# EAGLE schematic STXY (EAGLE 9.6.2)
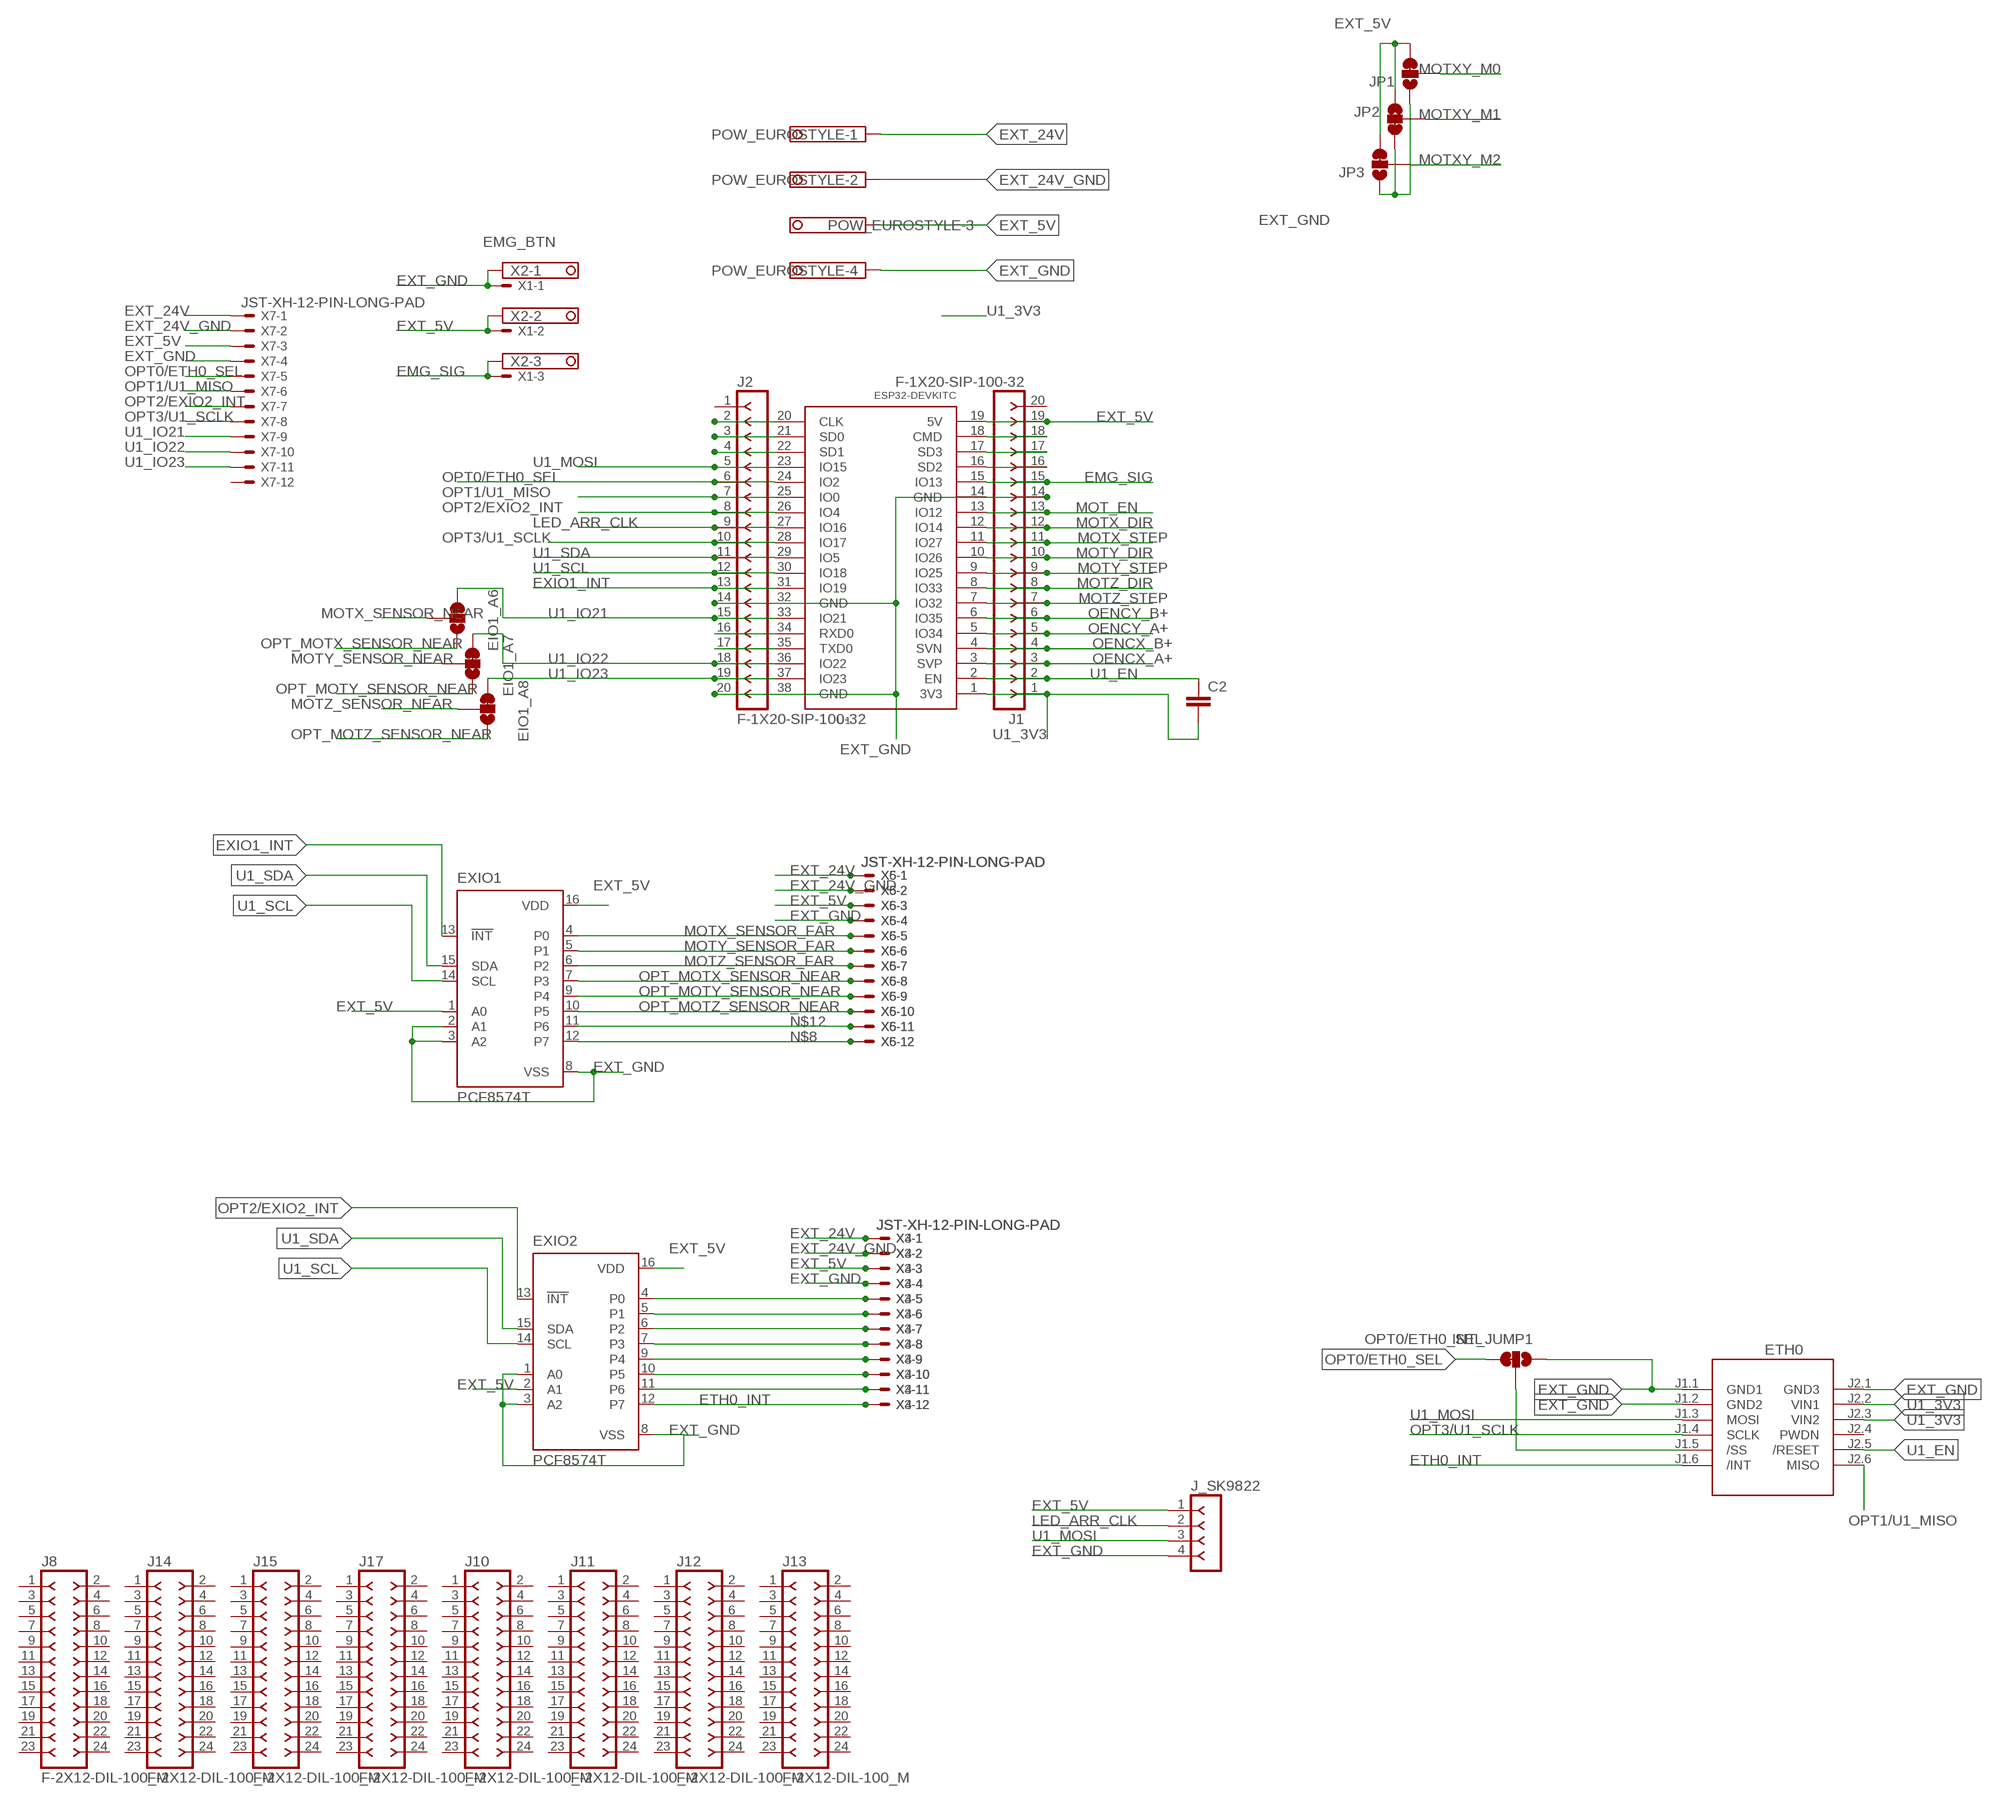
[diagram p0: schematic, sheet 1, part 1 of 3]
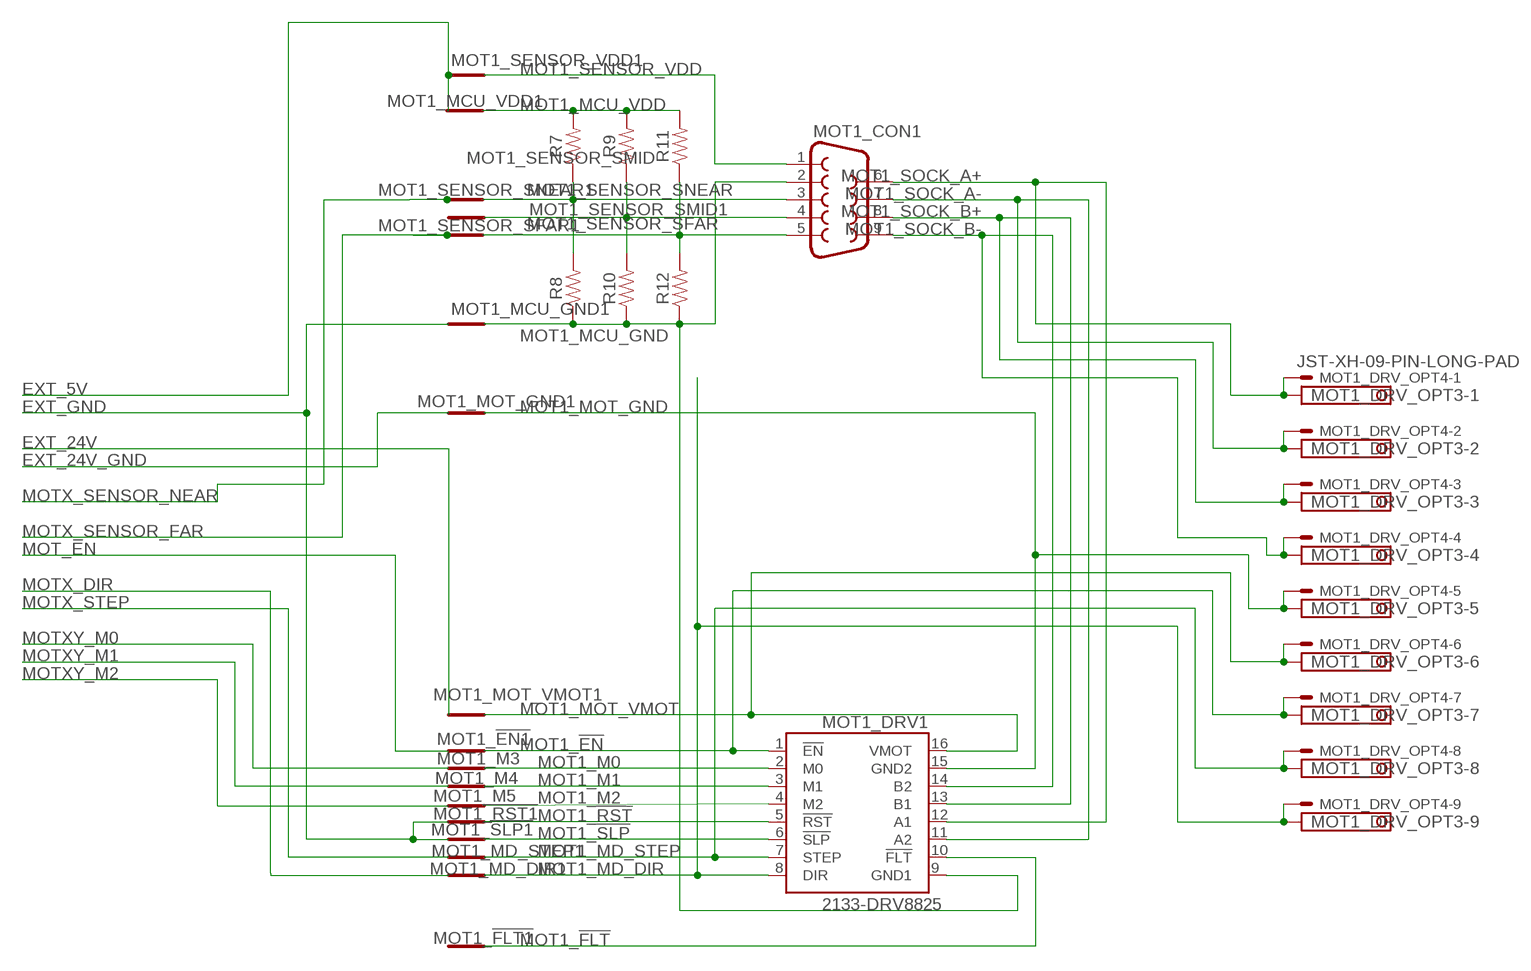
[diagram p1: schematic, sheet 1, part 2 of 3]
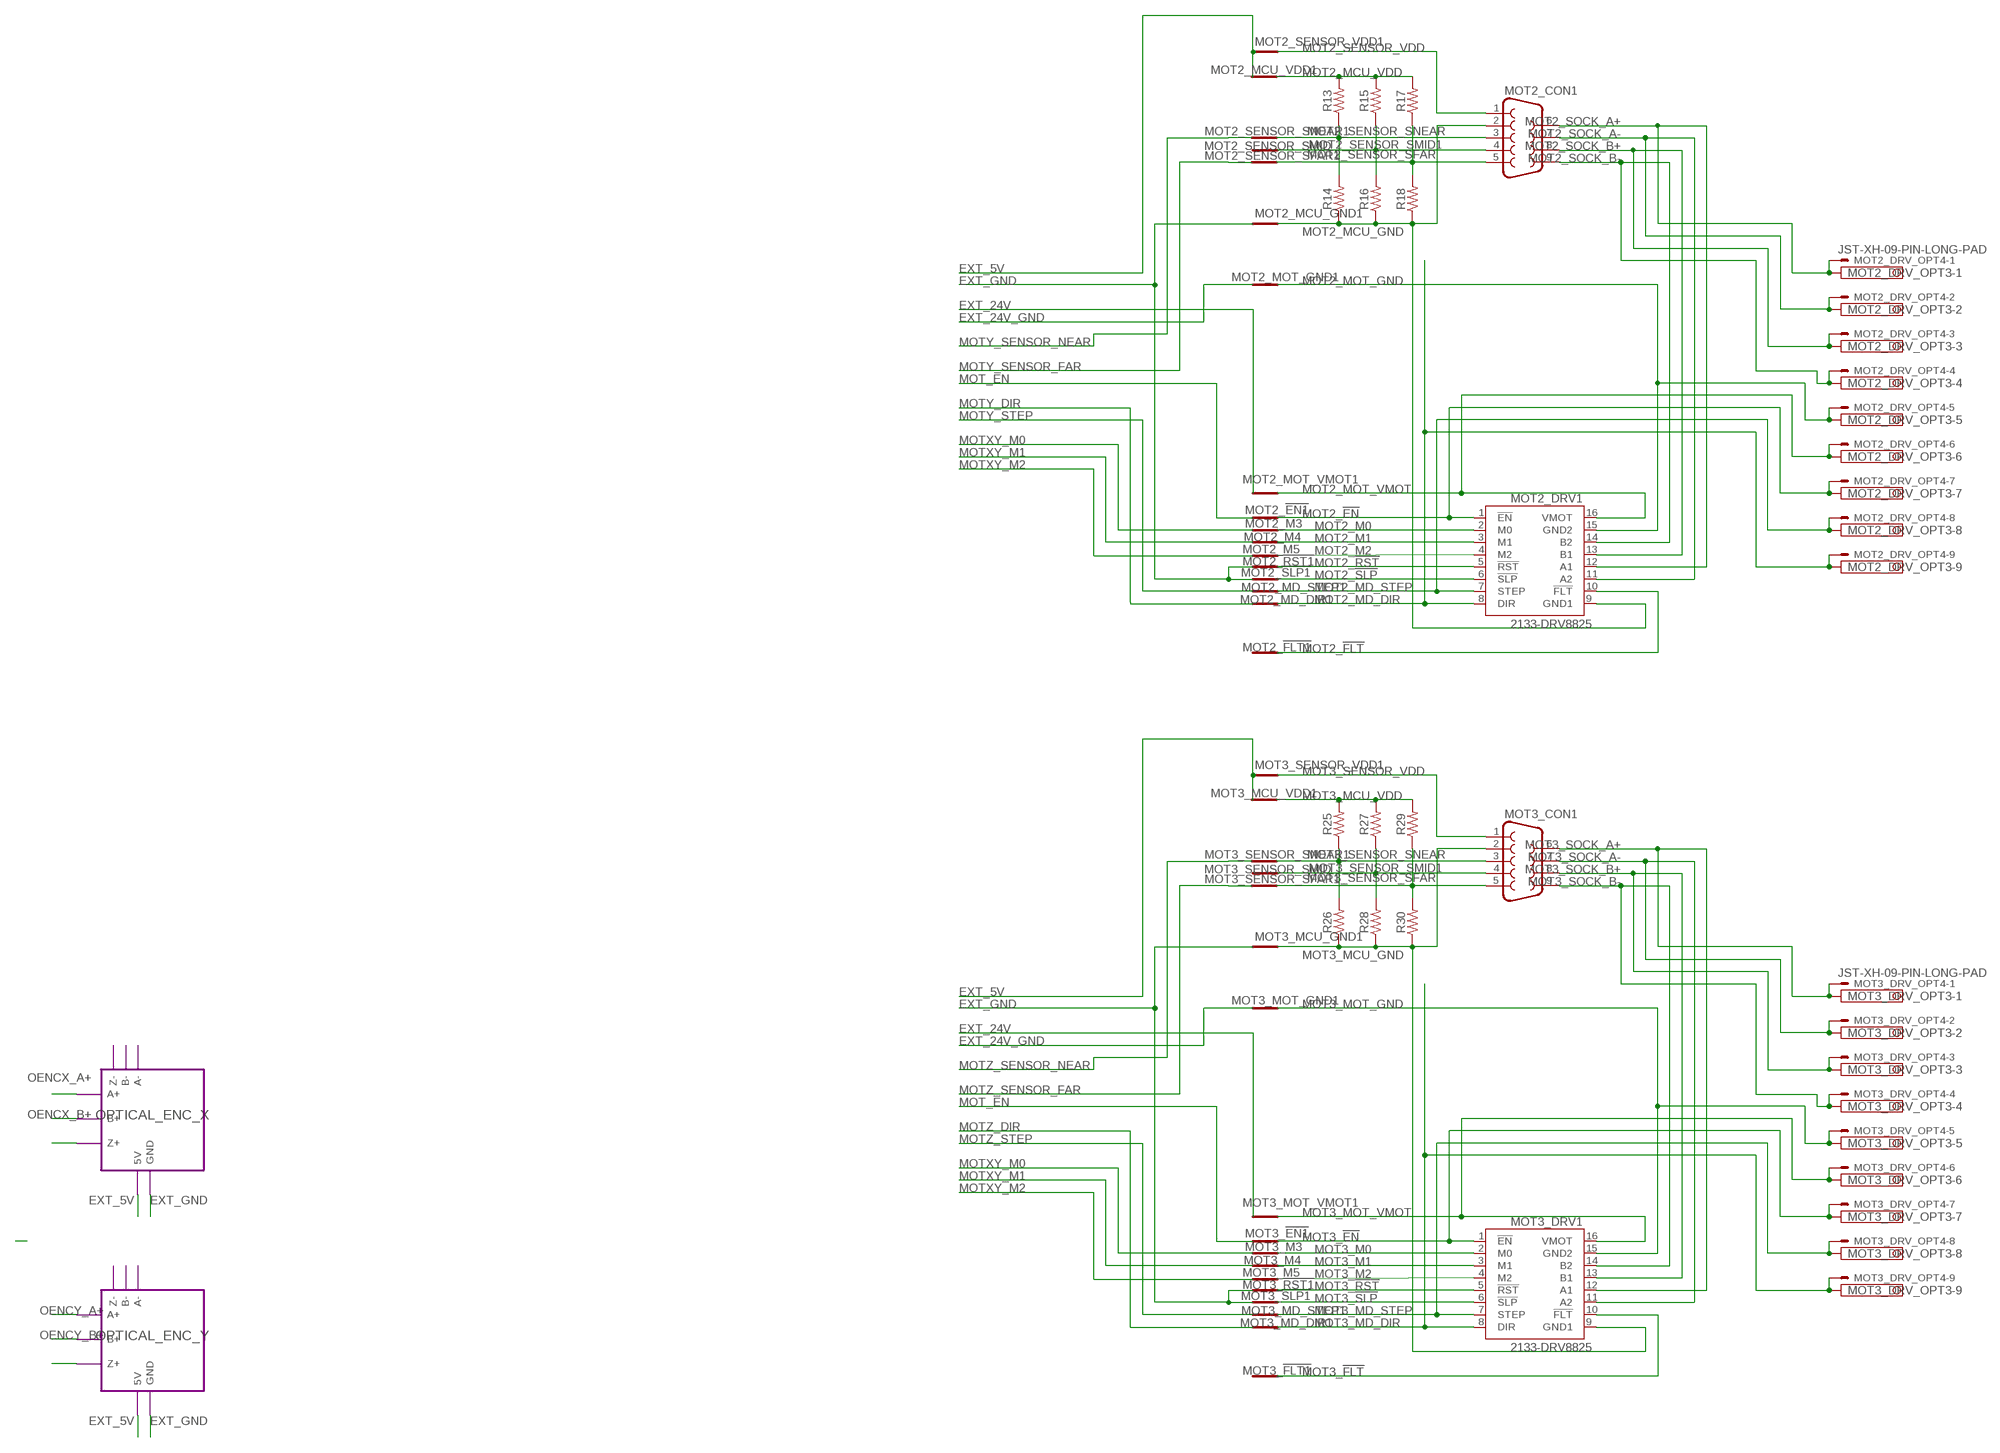
[diagram p2: schematic, sheet 1, part 3 of 3]

## Parts
C2  C2.5/2  [C2.5-2]
EIO1_A6  JUMPER-SMT_3_1-NC_TRACE_SILK  [SMT-JUMPER_3_1-NC_TRACE_SILK]
EIO1_A7  JUMPER-SMT_3_1-NC_TRACE_SILK  [SMT-JUMPER_3_1-NC_TRACE_SILK]
EIO1_A8  JUMPER-SMT_3_1-NC_TRACE_SILK  [SMT-JUMPER_3_1-NC_TRACE_SILK]
ETH0  WIZ820IO_DEVICE'DUAL-IN-LINE'  [WIZ820IO]
EXIO1  PCF8574T  [SO16W]
EXIO2  PCF8574T  [SO16W]
INT_JUMP1  JUMPER-SMT_3_1-NC_TRACE_SILK  [SMT-JUMPER_3_1-NC_TRACE_SILK]
J1  F-1X20-SIP-100-32  [SIP-100-20-32]
J2  F-1X20-SIP-100-32  [SIP-100-20-32]
J8  F-2X12-DIL-100_M  [DIL-100-2X12_M]
J10  F-2X12-DIL-100_M  [DIL-100-2X12_M]
J11  F-2X12-DIL-100_M  [DIL-100-2X12_M]
J12  F-2X12-DIL-100_M  [DIL-100-2X12_M]
J13  F-2X12-DIL-100_M  [DIL-100-2X12_M]
J14  F-2X12-DIL-100_M  [DIL-100-2X12_M]
J15  F-2X12-DIL-100_M  [DIL-100-2X12_M]
J17  F-2X12-DIL-100_M  [DIL-100-2X12_M]
J_SK9822  F-1X04-SIP-100-40Y  [SIP-100-04-40Y]
JP1  JUMPER-SMT_3_1-NC_TRACE_SILK  [SMT-JUMPER_3_1-NC_TRACE_SILK]
JP2  JUMPER-SMT_3_1-NC_TRACE_SILK  [SMT-JUMPER_3_1-NC_TRACE_SILK]
JP3  JUMPER-SMT_3_1-NC_TRACE_SILK  [SMT-JUMPER_3_1-NC_TRACE_SILK]
MOT1_!EN1  SHORTT5  [SHORT_TOP-50]
MOT1_!FLT1  SHORTT5  [SHORT_TOP-50]
MOT1_!RST1  SHORTT5  [SHORT_TOP-50]
MOT1_!SLP1  SHORTT5  [SHORT_TOP-50]
MOT1_CON1  F09VP  [F09VP]
MOT1_DRV1  2133-DRV8825  [DRV8825]
MOT1_DRV_OPT3  TERMINAL-BLOCK-3.5MM-9-PIN-ROUND-PAD  [TERMINAL-BLOCK-9-PIN-3.5MM-ROUND-PAD]
MOT1_DRV_OPT4  JST-XH-09-PIN-LONG-PAD  [JST-XH-09-PACKAGE-LONG-PAD]
MOT1_M3  SHORTT5  [SHORT_TOP-50]
MOT1_M4  SHORTT5  [SHORT_TOP-50]
MOT1_M5  SHORTT5  [SHORT_TOP-50]
MOT1_MCU_GND1  SHORTT5  [SHORT_TOP-50]
MOT1_MCU_VDD1  SHORTT5  [SHORT_TOP-50]
MOT1_MD_DIR1  SHORTT5  [SHORT_TOP-50]
MOT1_MD_STEP1  SHORTT5  [SHORT_TOP-50]
MOT1_MOT_GND1  SHORTT5  [SHORT_TOP-50]
MOT1_MOT_VMOT1  SHORTT5  [SHORT_TOP-50]
MOT1_SENSOR_SFAR1  SHORTT5  [SHORT_TOP-50]
MOT1_SENSOR_SMID1  SHORTT5  [SHORT_TOP-50]
MOT1_SENSOR_SNEAR1  SHORTT5  [SHORT_TOP-50]
MOT1_SENSOR_VDD1  SHORTT5  [SHORT_TOP-50]
MOT2_!EN1  SHORTT5  [SHORT_TOP-50]
MOT2_!FLT1  SHORTT5  [SHORT_TOP-50]
MOT2_!RST1  SHORTT5  [SHORT_TOP-50]
MOT2_!SLP1  SHORTT5  [SHORT_TOP-50]
MOT2_CON1  F09VP  [F09VP]
MOT2_DRV1  2133-DRV8825  [DRV8825]
MOT2_DRV_OPT3  TERMINAL-BLOCK-3.5MM-9-PIN-ROUND-PAD  [TERMINAL-BLOCK-9-PIN-3.5MM-ROUND-PAD]
MOT2_DRV_OPT4  JST-XH-09-PIN-LONG-PAD  [JST-XH-09-PACKAGE-LONG-PAD]
MOT2_M3  SHORTT5  [SHORT_TOP-50]
MOT2_M4  SHORTT5  [SHORT_TOP-50]
MOT2_M5  SHORTT5  [SHORT_TOP-50]
MOT2_MCU_GND1  SHORTT5  [SHORT_TOP-50]
MOT2_MCU_VDD1  SHORTT5  [SHORT_TOP-50]
MOT2_MD_DIR1  SHORTT5  [SHORT_TOP-50]
MOT2_MD_STEP1  SHORTT5  [SHORT_TOP-50]
MOT2_MOT_GND1  SHORTT5  [SHORT_TOP-50]
MOT2_MOT_VMOT1  SHORTT5  [SHORT_TOP-50]
MOT2_SENSOR_SFAR1  SHORTT5  [SHORT_TOP-50]
MOT2_SENSOR_SMID1  SHORTT5  [SHORT_TOP-50]
MOT2_SENSOR_SNEAR1  SHORTT5  [SHORT_TOP-50]
MOT2_SENSOR_VDD1  SHORTT5  [SHORT_TOP-50]
MOT3_!EN1  SHORTT5  [SHORT_TOP-50]
MOT3_!FLT1  SHORTT5  [SHORT_TOP-50]
MOT3_!RST1  SHORTT5  [SHORT_TOP-50]
MOT3_!SLP1  SHORTT5  [SHORT_TOP-50]
MOT3_CON1  F09VP  [F09VP]
MOT3_DRV1  2133-DRV8825  [DRV8825]
MOT3_DRV_OPT3  TERMINAL-BLOCK-3.5MM-9-PIN-ROUND-PAD  [TERMINAL-BLOCK-9-PIN-3.5MM-ROUND-PAD]
MOT3_DRV_OPT4  JST-XH-09-PIN-LONG-PAD  [JST-XH-09-PACKAGE-LONG-PAD]
MOT3_M3  SHORTT5  [SHORT_TOP-50]
MOT3_M4  SHORTT5  [SHORT_TOP-50]
MOT3_M5  SHORTT5  [SHORT_TOP-50]
MOT3_MCU_GND1  SHORTT5  [SHORT_TOP-50]
MOT3_MCU_VDD1  SHORTT5  [SHORT_TOP-50]
MOT3_MD_DIR1  SHORTT5  [SHORT_TOP-50]
MOT3_MD_STEP1  SHORTT5  [SHORT_TOP-50]
MOT3_MOT_GND1  SHORTT5  [SHORT_TOP-50]
MOT3_MOT_VMOT1  SHORTT5  [SHORT_TOP-50]
MOT3_SENSOR_SFAR1  SHORTT5  [SHORT_TOP-50]
MOT3_SENSOR_SMID1  SHORTT5  [SHORT_TOP-50]
MOT3_SENSOR_SNEAR1  SHORTT5  [SHORT_TOP-50]
MOT3_SENSOR_VDD1  SHORTT5  [SHORT_TOP-50]
POW_EUROSTYLE  TERMINAL-BLOCK-3.5MM-4-PIN-LONG-PAD  [TERMINAL-BLOCK-4-PIN-3.5MM-LONG-PAD]
R7  10KOHM-0603-1/10W-1%  [0603]
R8  10KOHM-0603-1/10W-1%  [0603]
R9  10KOHM-0603-1/10W-1%  [0603]
R10  10KOHM-0603-1/10W-1%  [0603]
R11  10KOHM-0603-1/10W-1%  [0603]
R12  10KOHM-0603-1/10W-1%  [0603]
R13  10KOHM-0603-1/10W-1%  [0603]
R14  10KOHM-0603-1/10W-1%  [0603]
R15  10KOHM-0603-1/10W-1%  [0603]
R16  10KOHM-0603-1/10W-1%  [0603]
R17  10KOHM-0603-1/10W-1%  [0603]
R18  10KOHM-0603-1/10W-1%  [0603]
R25  10KOHM-0603-1/10W-1%  [0603]
R26  10KOHM-0603-1/10W-1%  [0603]
R27  10KOHM-0603-1/10W-1%  [0603]
R28  10KOHM-0603-1/10W-1%  [0603]
R29  10KOHM-0603-1/10W-1%  [0603]
R30  10KOHM-0603-1/10W-1%  [0603]
U1  ESP32DEVKITC  [ESP32-DEVKITC]
X1  EMG_BTN  JST-XH-03-PIN-LONG-PAD  [JST-XH-03-PACKAGE-LONG-PAD]
X2  TERMINAL-BLOCK-3.5MM-3-PIN-LONG-PAD  [TERMINAL-BLOCK-3-PIN-3.5MM-LONG-PAD]
X3  JST-XH-12-PIN-LONG-PAD  [JST-XH-12-PACKAGE-LONG-PAD]
X4  JST-XH-12-PIN-LONG-PAD  [JST-XH-12-PACKAGE-LONG-PAD]
X5  JST-XH-12-PIN-LONG-PAD  [JST-XH-12-PACKAGE-LONG-PAD]
X6  JST-XH-12-PIN-LONG-PAD  [JST-XH-12-PACKAGE-LONG-PAD]
X7  JST-XH-12-PIN-LONG-PAD  [JST-XH-12-PACKAGE-LONG-PAD]

## Module instances
OPTICAL_ENC_X = OPTICAL_ENC
OPTICAL_ENC_Y = OPTICAL_ENC

## Nets
EMG_SIG: J1.15 U1.15(IO13) X1.3 X2.3
ETH0_INT: ETH0.J1.6(/INT) EXIO2.12(P7) X3.12 X4.12
EXIO1_INT: EXIO1.13(!INT) J2.13 U1.31(IO19)
EXT_5V [M POWER]: EXIO1.1(A0) EXIO1.16(VDD) EXIO2.2(A1) EXIO2.16(VDD) J1.19 J_SK9822.1 JP1.3 JP2.1 JP3.3 MOT1_MCU_VDD1.1 MOT1_SENSOR_VDD1.1 MOT2_MCU_VDD1.1 MOT2_SENSOR_VDD1.1 MOT3_MCU_VDD1.1 MOT3_SENSOR_VDD1.1 POW_EUROSTYLE.3 U1.19(5V) X1.2 X2.2 X3.3 X4.3 X5.3 X6.3 X7.3 ; port OPTICAL_ENC_X.5V OPTICAL_ENC_Y.5V
EXT_24V [H POWER]: MOT1_MOT_VMOT1.1 MOT2_MOT_VMOT1.1 MOT3_MOT_VMOT1.1 POW_EUROSTYLE.1 X3.1 X4.1 X5.1 X6.1 X7.1
EXT_24V_GND [H POWER]: MOT1_MOT_GND1.1 MOT2_MOT_GND1.1 MOT3_MOT_GND1.1 POW_EUROSTYLE.2 X3.2 X4.2 X5.2 X6.2 X7.2
EXT_GND [M POWER]: ETH0.J1.1(GND1) ETH0.J1.2(GND2) ETH0.J2.1(GND3) EXIO1.2(A1) EXIO1.3(A2) EXIO1.8(VSS) EXIO2.1(A0) EXIO2.3(A2) EXIO2.8(VSS) INT_JUMP1.1 J1.14 J2.14 J2.20 J_SK9822.4 JP1.1 JP2.3 JP3.1 MOT1_!RST1.1 MOT1_!SLP1.1 MOT1_MCU_GND1.1 MOT2_!RST1.1 MOT2_!SLP1.1 MOT2_MCU_GND1.1 MOT3_!RST1.1 MOT3_!SLP1.1 MOT3_MCU_GND1.1 POW_EUROSTYLE.4 U1.14(GND) U1.32(GND) U1.38(GND) X1.1 X2.1 X3.4 X4.4 X5.4 X6.4 X7.4 ; port OPTICAL_ENC_X.GND OPTICAL_ENC_Y.GND
LED_ARR_CLK: J2.9 J_SK9822.2 U1.27(IO16)
MOT1_!EN [S POWER]: MOT1_!EN1.2 MOT1_DRV1.1(!EN) MOT1_DRV_OPT3.7 MOT1_DRV_OPT4.7
MOT1_!FLT [S POWER]: MOT1_!FLT1.2 MOT1_DRV1.10(!FLT)
MOT1_!RST [S POWER]: MOT1_!RST1.2 MOT1_DRV1.5(!RST)
MOT1_!SLP [S POWER]: MOT1_!SLP1.2 MOT1_DRV1.6(!SLP)
MOT1_M0 [S POWER]: MOT1_DRV1.2(M0) MOT1_M3.2
MOT1_M1 [S POWER]: MOT1_DRV1.3(M1) MOT1_M4.2
MOT1_M2 [S POWER]: MOT1_DRV1.4(M2) MOT1_M5.2
MOT1_MCU_GND [M POWER]: MOT1_CON1.2 MOT1_DRV1.9(GND1) MOT1_MCU_GND1.2 R8.1 R10.1 R12.1
MOT1_MCU_VDD [M POWER]: MOT1_MCU_VDD1.2 R7.2 R9.2 R11.2
MOT1_MD_DIR [S POWER]: MOT1_DRV1.8(DIR) MOT1_DRV_OPT3.9 MOT1_DRV_OPT4.9 MOT1_MD_DIR1.2
MOT1_MD_STEP [S POWER]: MOT1_DRV1.7(STEP) MOT1_DRV_OPT3.8 MOT1_DRV_OPT4.8 MOT1_MD_STEP1.2
MOT1_MOT_GND [H POWER]: MOT1_DRV1.15(GND2) MOT1_DRV_OPT3.5 MOT1_DRV_OPT4.5 MOT1_MOT_GND1.2
MOT1_MOT_VMOT [H POWER]: MOT1_DRV1.16(VMOT) MOT1_DRV_OPT3.6 MOT1_DRV_OPT4.6 MOT1_MOT_VMOT1.2
MOT1_SENSOR_SFAR [S POWER]: MOT1_CON1.5 MOT1_SENSOR_SFAR1.2 R11.1 R12.2
MOT1_SENSOR_SMID [S POWER]: MOT1_CON1.4 MOT1_SENSOR_SMID1.2 R9.1 R10.2
MOT1_SENSOR_SNEAR [S POWER]: MOT1_CON1.3 MOT1_SENSOR_SNEAR1.2 R7.1 R8.2
MOT1_SENSOR_VDD [M POWER]: MOT1_CON1.1 MOT1_SENSOR_VDD1.2
MOT1_SOCK_A+ [M POWER]: MOT1_CON1.6 MOT1_DRV1.12(A1) MOT1_DRV_OPT3.1 MOT1_DRV_OPT4.1
MOT1_SOCK_A- [M POWER]: MOT1_CON1.7 MOT1_DRV1.11(A2) MOT1_DRV_OPT3.2 MOT1_DRV_OPT4.2
MOT1_SOCK_B+ [M POWER]: MOT1_CON1.8 MOT1_DRV1.13(B1) MOT1_DRV_OPT3.3 MOT1_DRV_OPT4.3
MOT1_SOCK_B- [M POWER]: MOT1_CON1.9 MOT1_DRV1.14(B2) MOT1_DRV_OPT3.4 MOT1_DRV_OPT4.4
MOT2_!EN [S POWER]: MOT2_!EN1.2 MOT2_DRV1.1(!EN) MOT2_DRV_OPT3.7 MOT2_DRV_OPT4.7
MOT2_!FLT [S POWER]: MOT2_!FLT1.2 MOT2_DRV1.10(!FLT)
MOT2_!RST [S POWER]: MOT2_!RST1.2 MOT2_DRV1.5(!RST)
MOT2_!SLP [S POWER]: MOT2_!SLP1.2 MOT2_DRV1.6(!SLP)
MOT2_M0 [S POWER]: MOT2_DRV1.2(M0) MOT2_M3.2
MOT2_M1 [S POWER]: MOT2_DRV1.3(M1) MOT2_M4.2
MOT2_M2 [S POWER]: MOT2_DRV1.4(M2) MOT2_M5.2
MOT2_MCU_GND [M POWER]: MOT2_CON1.2 MOT2_DRV1.9(GND1) MOT2_MCU_GND1.2 R14.1 R16.1 R18.1
MOT2_MCU_VDD [M POWER]: MOT2_MCU_VDD1.2 R13.2 R15.2 R17.2
MOT2_MD_DIR [S POWER]: MOT2_DRV1.8(DIR) MOT2_DRV_OPT3.9 MOT2_DRV_OPT4.9 MOT2_MD_DIR1.2
MOT2_MD_STEP [S POWER]: MOT2_DRV1.7(STEP) MOT2_DRV_OPT3.8 MOT2_DRV_OPT4.8 MOT2_MD_STEP1.2
MOT2_MOT_GND [H POWER]: MOT2_DRV1.15(GND2) MOT2_DRV_OPT3.5 MOT2_DRV_OPT4.5 MOT2_MOT_GND1.2
MOT2_MOT_VMOT [H POWER]: MOT2_DRV1.16(VMOT) MOT2_DRV_OPT3.6 MOT2_DRV_OPT4.6 MOT2_MOT_VMOT1.2
MOT2_SENSOR_SFAR [S POWER]: MOT2_CON1.5 MOT2_SENSOR_SFAR1.2 R17.1 R18.2
MOT2_SENSOR_SMID [S POWER]: MOT2_CON1.4 MOT2_SENSOR_SMID1.2 R15.1 R16.2
MOT2_SENSOR_SNEAR [S POWER]: MOT2_CON1.3 MOT2_SENSOR_SNEAR1.2 R13.1 R14.2
MOT2_SENSOR_VDD [M POWER]: MOT2_CON1.1 MOT2_SENSOR_VDD1.2
MOT2_SOCK_A+ [M POWER]: MOT2_CON1.6 MOT2_DRV1.12(A1) MOT2_DRV_OPT3.1 MOT2_DRV_OPT4.1
MOT2_SOCK_A- [M POWER]: MOT2_CON1.7 MOT2_DRV1.11(A2) MOT2_DRV_OPT3.2 MOT2_DRV_OPT4.2
MOT2_SOCK_B+ [M POWER]: MOT2_CON1.8 MOT2_DRV1.13(B1) MOT2_DRV_OPT3.3 MOT2_DRV_OPT4.3
MOT2_SOCK_B- [M POWER]: MOT2_CON1.9 MOT2_DRV1.14(B2) MOT2_DRV_OPT3.4 MOT2_DRV_OPT4.4
MOT3_!EN [S POWER]: MOT3_!EN1.2 MOT3_DRV1.1(!EN) MOT3_DRV_OPT3.7 MOT3_DRV_OPT4.7
MOT3_!FLT [S POWER]: MOT3_!FLT1.2 MOT3_DRV1.10(!FLT)
MOT3_!RST [S POWER]: MOT3_!RST1.2 MOT3_DRV1.5(!RST)
MOT3_!SLP [S POWER]: MOT3_!SLP1.2 MOT3_DRV1.6(!SLP)
MOT3_M0 [S POWER]: MOT3_DRV1.2(M0) MOT3_M3.2
MOT3_M1 [S POWER]: MOT3_DRV1.3(M1) MOT3_M4.2
MOT3_M2 [S POWER]: MOT3_DRV1.4(M2) MOT3_M5.2
MOT3_MCU_GND [M POWER]: MOT3_CON1.2 MOT3_DRV1.9(GND1) MOT3_MCU_GND1.2 R26.1 R28.1 R30.1
MOT3_MCU_VDD [M POWER]: MOT3_MCU_VDD1.2 R25.2 R27.2 R29.2
MOT3_MD_DIR [S POWER]: MOT3_DRV1.8(DIR) MOT3_DRV_OPT3.9 MOT3_DRV_OPT4.9 MOT3_MD_DIR1.2
MOT3_MD_STEP [S POWER]: MOT3_DRV1.7(STEP) MOT3_DRV_OPT3.8 MOT3_DRV_OPT4.8 MOT3_MD_STEP1.2
MOT3_MOT_GND [H POWER]: MOT3_DRV1.15(GND2) MOT3_DRV_OPT3.5 MOT3_DRV_OPT4.5 MOT3_MOT_GND1.2
MOT3_MOT_VMOT [H POWER]: MOT3_DRV1.16(VMOT) MOT3_DRV_OPT3.6 MOT3_DRV_OPT4.6 MOT3_MOT_VMOT1.2
MOT3_SENSOR_SFAR [S POWER]: MOT3_CON1.5 MOT3_SENSOR_SFAR1.2 R29.1 R30.2
MOT3_SENSOR_SMID [S POWER]: MOT3_CON1.4 MOT3_SENSOR_SMID1.2 R27.1 R28.2
MOT3_SENSOR_SNEAR [S POWER]: MOT3_CON1.3 MOT3_SENSOR_SNEAR1.2 R25.1 R26.2
MOT3_SENSOR_VDD [M POWER]: MOT3_CON1.1 MOT3_SENSOR_VDD1.2
MOT3_SOCK_A+ [M POWER]: MOT3_CON1.6 MOT3_DRV1.12(A1) MOT3_DRV_OPT3.1 MOT3_DRV_OPT4.1
MOT3_SOCK_A- [M POWER]: MOT3_CON1.7 MOT3_DRV1.11(A2) MOT3_DRV_OPT3.2 MOT3_DRV_OPT4.2
MOT3_SOCK_B+ [M POWER]: MOT3_CON1.8 MOT3_DRV1.13(B1) MOT3_DRV_OPT3.3 MOT3_DRV_OPT4.3
MOT3_SOCK_B- [M POWER]: MOT3_CON1.9 MOT3_DRV1.14(B2) MOT3_DRV_OPT3.4 MOT3_DRV_OPT4.4
MOT_EN: J1.13 MOT1_!EN1.1 MOT2_!EN1.1 MOT3_!EN1.1 U1.13(IO12)
MOTX_DIR: J1.12 MOT1_MD_DIR1.1 U1.12(IO14)
MOTX_SENSOR_FAR: EXIO1.4(P0) MOT1_SENSOR_SFAR1.1 X5.5 X6.5
MOTX_SENSOR_NEAR: EIO1_A6.2 MOT1_SENSOR_SNEAR1.1
MOTX_STEP: J1.11 MOT1_MD_STEP1.1 U1.11(IO27)
MOTXY_M0: JP1.2 MOT1_M3.1 MOT2_M3.1 MOT3_M3.1
MOTXY_M1: JP2.2 MOT1_M4.1 MOT2_M4.1 MOT3_M4.1
MOTXY_M2: JP3.2 MOT1_M5.1 MOT2_M5.1 MOT3_M5.1
MOTY_DIR: J1.10 MOT2_MD_DIR1.1 U1.10(IO26)
MOTY_SENSOR_FAR: EXIO1.5(P1) MOT2_SENSOR_SFAR1.1 X5.6 X6.6
MOTY_SENSOR_NEAR: EIO1_A7.2 MOT2_SENSOR_SNEAR1.1
MOTY_STEP: J1.9 MOT2_MD_STEP1.1 U1.9(IO25)
MOTZ_DIR: J1.8 MOT3_MD_DIR1.1 U1.8(IO33)
MOTZ_SENSOR_FAR: EXIO1.6(P2) MOT3_SENSOR_SFAR1.1 X5.7 X6.7
MOTZ_SENSOR_NEAR: EIO1_A8.2 MOT3_SENSOR_SNEAR1.1
MOTZ_STEP: J1.7 MOT3_MD_STEP1.1 U1.7(IO32)
N$3: port OPTICAL_ENC_X.Z+
N$6: port OPTICAL_ENC_Y.Z+
N$8: EXIO1.12(P7) X5.12 X6.12
N$12: EXIO1.11(P6) X5.11 X6.11
N$14: EXIO2.4(P0) X3.5 X4.5
N$15: EXIO2.5(P1) X3.6 X4.6
N$16: EXIO2.6(P2) X3.7 X4.7
N$17: EXIO2.7(P3) X3.8 X4.8
N$18: EXIO2.9(P4) X3.9 X4.9
N$19: J1.18 U1.18(CMD)
N$21: EXIO2.10(P5) X3.10 X4.10
N$22: ETH0.J1.5(/SS) INT_JUMP1.2
N$23: EXIO2.11(P6) X3.11 X4.11
OENCX_A+: J1.3 U1.3(SVP) ; port OPTICAL_ENC_X.A+
OENCX_B+: J1.4 U1.4(SVN) ; port OPTICAL_ENC_X.B+
OENCY_A+: J1.5 U1.5(IO34) ; port OPTICAL_ENC_Y.A+
OENCY_B+: J1.6 U1.6(IO35) ; port OPTICAL_ENC_Y.B+
OPT0/ETH0_SEL: INT_JUMP1.3 J2.6 U1.24(IO2) X7.5
OPT1/U1_MISO: ETH0.J2.6(MISO) J2.7 U1.25(IO0) X7.6
OPT2/EXIO2_INT: EXIO2.13(!INT) J2.8 U1.26(IO4) X7.7
OPT3/U1_SCLK: ETH0.J1.4(SCLK) J2.10 U1.28(IO17) X7.8
OPT_MOTX_SENSOR_NEAR: EIO1_A6.1 EXIO1.7(P3) X5.8 X6.8
OPT_MOTY_SENSOR_NEAR: EIO1_A7.1 EXIO1.9(P4) X5.9 X6.9
OPT_MOTZ_SENSOR_NEAR: EIO1_A8.1 EXIO1.10(P5) X5.10 X6.10
U1_3V3 [M POWER]: C2.2 ETH0.J2.2(VIN1) ETH0.J2.3(VIN2) J1.1 U1.1(3V3)
U1_CLK: J2.2 U1.20(CLK)
U1_EN: C2.1 ETH0.J2.5(/RESET) J1.2 U1.2(EN)
U1_IO21: EIO1_A6.3 J2.15 U1.33(IO21) X7.9
U1_IO22: EIO1_A7.3 J2.18 U1.36(IO22) X7.10
U1_IO23: EIO1_A8.3 J2.19 U1.37(IO23) X7.11
U1_MOSI: ETH0.J1.3(MOSI) J2.5 J_SK9822.3 U1.23(IO15)
U1_RXD0: J2.16 U1.34(RXD0)
U1_SCL: EXIO1.14(SCL) EXIO2.14(SCL) J2.12 U1.30(IO18)
U1_SD0: J2.3 U1.21(SD0)
U1_SD1: J2.4 U1.22(SD1)
U1_SD2: J1.16 U1.16(SD2)
U1_SD3: J1.17 U1.17(SD3)
U1_SDA: EXIO1.15(SDA) EXIO2.15(SDA) J2.11 U1.29(IO5)
U1_TXD0: J2.17 U1.35(TXD0)
Unconnected: ETH0.J2.4(PWDN) J1.20 J2.1 J8.1 J8.2 J8.3 J8.4 J8.5 J8.6 J8.7 J8.8 J8.9 J8.10 J8.11 J8.12 J8.13 J8.14 J8.15 J8.16 J8.17 J8.18 J8.19 J8.20 J8.21 J8.22 J8.23 J8.24 J10.1 J10.2 J10.3 J10.4 J10.5 J10.6 J10.7 J10.8 J10.9 J10.10 J10.11 J10.12 J10.13 J10.14 J10.15 J10.16 J10.17 J10.18 J10.19 J10.20 J10.21 J10.22 J10.23 J10.24 J11.1 J11.2 J11.3 J11.4 J11.5 J11.6 J11.7 J11.8 J11.9 J11.10 J11.11 J11.12 J11.13 J11.14 J11.15 J11.16 J11.17 J11.18 J11.19 J11.20 J11.21 J11.22 J11.23 J11.24 J12.1 J12.2 J12.3 J12.4 J12.5 J12.6 J12.7 J12.8 J12.9 J12.10 J12.11 J12.12 J12.13 J12.14 J12.15 J12.16 J12.17 J12.18 J12.19 J12.20 J12.21 J12.22 J12.23 J12.24 J13.1 J13.2 J13.3 J13.4 J13.5 J13.6 J13.7 J13.8 J13.9 J13.10 J13.11 J13.12 J13.13 J13.14 J13.15 J13.16 J13.17 J13.18 J13.19 J13.20 J13.21 J13.22 J13.23 J13.24 J14.1 J14.2 J14.3 J14.4 J14.5 J14.6 J14.7 J14.8 J14.9 J14.10 J14.11 J14.12 J14.13 J14.14 J14.15 J14.16 J14.17 J14.18 J14.19 J14.20 J14.21 J14.22 J14.23 J14.24 J15.1 J15.2 J15.3 J15.4 J15.5 J15.6 J15.7 J15.8 J15.9 J15.10 J15.11 J15.12 J15.13 J15.14 J15.15 J15.16 J15.17 J15.18 J15.19 J15.20 J15.21 J15.22 J15.23 J15.24 J17.1 J17.2 J17.3 J17.4 J17.5 J17.6 J17.7 J17.8 J17.9 J17.10 J17.11 J17.12 J17.13 J17.14 J17.15 J17.16 J17.17 J17.18 J17.19 J17.20 J17.21 J17.22 J17.23 J17.24 MOT1_!FLT1.1 MOT1_SENSOR_SMID1.1 MOT2_!FLT1.1 MOT2_SENSOR_SMID1.1 MOT3_!FLT1.1 MOT3_SENSOR_SMID1.1 X7.12

## Library data of the parts
C2 = capacitor-wima:C: CAPACITOR naming: grid - package width
EIO1_A6-EIO1_A8 INT_JUMP1 JP1-JP3 = SparkFun-Jumpers:JUMPER-SMT_3_1-NC_TRACE: Normally closed trace jumper (1 of 2 connections) This jumper has a trace between two pads so it's normally closed (NC). The other connection is normally open (NO). Use a razor knife to open the connection. For best results follow the IPC guidelines for cutting traces: Cutout at least 0.063 mm (0.005 in). Remove all loose material to clean up the cut area. Seal the cut with an approved epoxy. Reapply solder to reclose the connection, or to close the NO connection.
ETH0 = Wiz820io:WIZ820IO_DEVICE: WIZnet, WIZ820io plug in module incl. W5200 chip and MagJack
EXIO1 EXIO2 = micro-philips:PCF8574: I2C-Bus Remote 8-bit I/O expander http://www.semiconductors.philips.com/acrobat_download/datasheets/PCF8574_4.pdf
J1 J2 = con-headers-jp:F-1X20-: FEMALE HEADER
J8 J10-J15 J17 = con-headers-jp:F-2X12-: FEMALE HEADER
J_SK9822 = con-headers-jp:F-1X04-: FEMALE HEADER
MOT1_!EN1 MOT1_!FLT1 MOT1_!RST1 MOT1_!SLP1 MOT1_M3-MOT1_M5 MOT1_MCU_GND1 MOT1_MCU_VDD1 MOT1_MD_DIR1 MOT1_MD_STEP1 MOT1_MOT_GND1 MOT1_MOT_VMOT1 MOT1_SENSOR_SFAR1 MOT1_SENSOR_SMID1 MOT1_SENSOR_SNEAR1 MOT1_SENSOR_VDD1 MOT2_!EN1 MOT2_!FLT1 MOT2_!RST1 MOT2_!SLP1 MOT2_M3-MOT2_M5 MOT2_MCU_GND1 MOT2_MCU_VDD1 MOT2_MD_DIR1 MOT2_MD_STEP1 MOT2_MOT_GND1 MOT2_MOT_VMOT1 MOT2_SENSOR_SFAR1 MOT2_SENSOR_SMID1 MOT2_SENSOR_SNEAR1 MOT2_SENSOR_VDD1 MOT3_!EN1 MOT3_!FLT1 MOT3_!RST1 MOT3_!SLP1 MOT3_M3-MOT3_M5 MOT3_MCU_GND1 MOT3_MCU_VDD1 MOT3_MD_DIR1 MOT3_MD_STEP1 MOT3_MOT_GND1 MOT3_MOT_VMOT1 MOT3_SENSOR_SFAR1 MOT3_SENSOR_SMID1 MOT3_SENSOR_SNEAR1 MOT3_SENSOR_VDD1 = shorts:SHORT: Short between two nets; BOM: no
MOT1_CON1 MOT2_CON1 MOT3_CON1 = con-subd:F09: SUB-D; OC_FARNELL: unknown; OC_NEWARK: unknown
MOT1_DRV1 MOT2_DRV1 MOT3_DRV1 = pololu-stepper-driver:2133-DRV8825: DRV8825 Stepper Motor Driver Carrier, High Current #2133 DRV8825 Stepper Motor Driver Carrier; High Current <https://www.pololu.com/product/2133> in Japan, Suzaku Lab. Ltd. <https://suzakugiken.jp/> #2133 DRV8825 大電流用ステッピングモータドライバ <https://szc.jp/po2133>
MOT1_DRV_OPT3 MOT2_DRV_OPT3 MOT3_DRV_OPT3 = Rembrandt Electronics - Terminal Block 3-5mm v1-0 2:TERMINAL-BLOCK-3.5MM-9-PIN: Terminal Block 3.5mm Pitch: 3,5 mm Number of pins: 9 Created by Rembrandt Electronics www.rembrandtelectronics.com
MOT1_DRV_OPT4 MOT2_DRV_OPT4 MOT3_DRV_OPT4 = Rembrandt Electronics - JST XH Connectors v1-0:JST-XH-09-PIN: JST XH Connector 2 Pin Wire to board connector. Pitch: 2,54 mm, (0.100") Number of pins: 9 Created by Rembrandt Electronics www.rembrandtelectronics.com
POW_EUROSTYLE = Rembrandt Electronics - Terminal Block 3-5mm v1-0 2:TERMINAL-BLOCK-3.5MM-4-PIN: Terminal Block 3.5mm Pitch: 3,5 mm Number of pins: 4 Created by Rembrandt Electronics www.rembrandtelectronics.com
R7-R18 R25-R30 = SparkFun-Resistors:10KOHM: 10kΩ resistor A resistor is a passive two-terminal electrical component that implements electrical resistance as a circuit element. Resistors act to reduce current flow, and, at the same time, act to lower voltage levels within circuits. - Wikipedia; PROD_ID: RES-00824; VALUE: 10k
U1 = ESP32-DEVKITC:ESP32DEVKITC
X1 = Rembrandt Electronics - JST XH Connectors v1-0:JST-XH-03-PIN: JST XH Connector 2 Pin Wire to board connector. Pitch: 2,54 mm, (0.100") Number of pins: 3 Created by Rembrandt Electronics www.rembrandtelectronics.com
X2 = Rembrandt Electronics - Terminal Block 3-5mm v1-0 2:TERMINAL-BLOCK-3.5MM-3-PIN: Terminal Block 3.5mm Pitch: 3,5 mm Number of pins: 3 Created by Rembrandt Electronics www.rembrandtelectronics.com
X3-X7 = Rembrandt Electronics - JST XH Connectors v1-0:JST-XH-12-PIN: JST XH Connector 2 Pin Wire to board connector. Pitch: 2,54 mm, (0.100") Number of pins: 12 Created by Rembrandt Electronics www.rembrandtelectronics.com

## Module OPTICAL_ENC
Ports: A+(out) B+(out) Z+(out) 5V(in) GND(io) A-(out) B-(out) Z-(out)
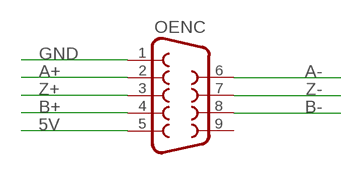
[diagram p3: schematic, module OPTICAL_ENC, sheet 1]

### Parts
OENC  F09VP  [F09VP]

### Nets
5V: OENC.5
A+: OENC.2
A-: OENC.6
B+: OENC.4
B-: OENC.8
GND: OENC.1
Z+: OENC.3
Z-: OENC.7
Unconnected: OENC.9

### Library data of the parts
OENC = con-subd:F09: SUB-D; OC_FARNELL: unknown; OC_NEWARK: unknown

## Net classes
0 default: width 0.254 mm, clearance 0.127 mm
1 H POWER: width 1.27 mm, drill 1.524 mm, clearance 0.33 mm
2 M POWER: width 0.762 mm, drill 1.016 mm, clearance 0.254 mm
3 S POWER: width 0.254 mm, clearance 0.254 mm